# Altium schematic sheet processor.SchDoc: MSP430FR2633 EVM Processor Module
size 431 x 279 mm; Date: Not shown in title block; ApprovedBy: Not shown in title block; CheckedBy: Not shown in title block; Author: Not shown in title block; CompanyName: Not shown in title block; Engineer: Not shown in title block; Organization: Not shown in title block; Address1: Not shown in title block; Address2: Not shown in title block; Address3: Not shown in title block; Address4: Not shown in title block; DocumentNumber: 2; Revision: Use project parameter SCH_Rev; SheetNumber: 2; SheetTotal: 3; PageSetup: Record=PageOptions|CenterHorizontal=True|CenterVertical=True|PrintScale=1.00|XCorrection=1.00|YCorrection=1.00|PrintKind=0|BorderSize=5000000|LeftOffset=0|BottomOffset=0|Orientation=2|PaperLength=1000|PaperWidth=1000|Scale=100|PaperSource=15|PrintQuality=600|MediaType=1|DitherType=10|PaperKind=Letter|PrintScaleMode=1; CurrentTime: Not shown in title block; CurrentDate: Not shown in title block; Time: Not shown in title block; DocumentFullPathAndName: Not shown in title block; DocumentName: Not shown in title block; ModifiedDate: Not shown in title block; ImagePath: Not shown in title block
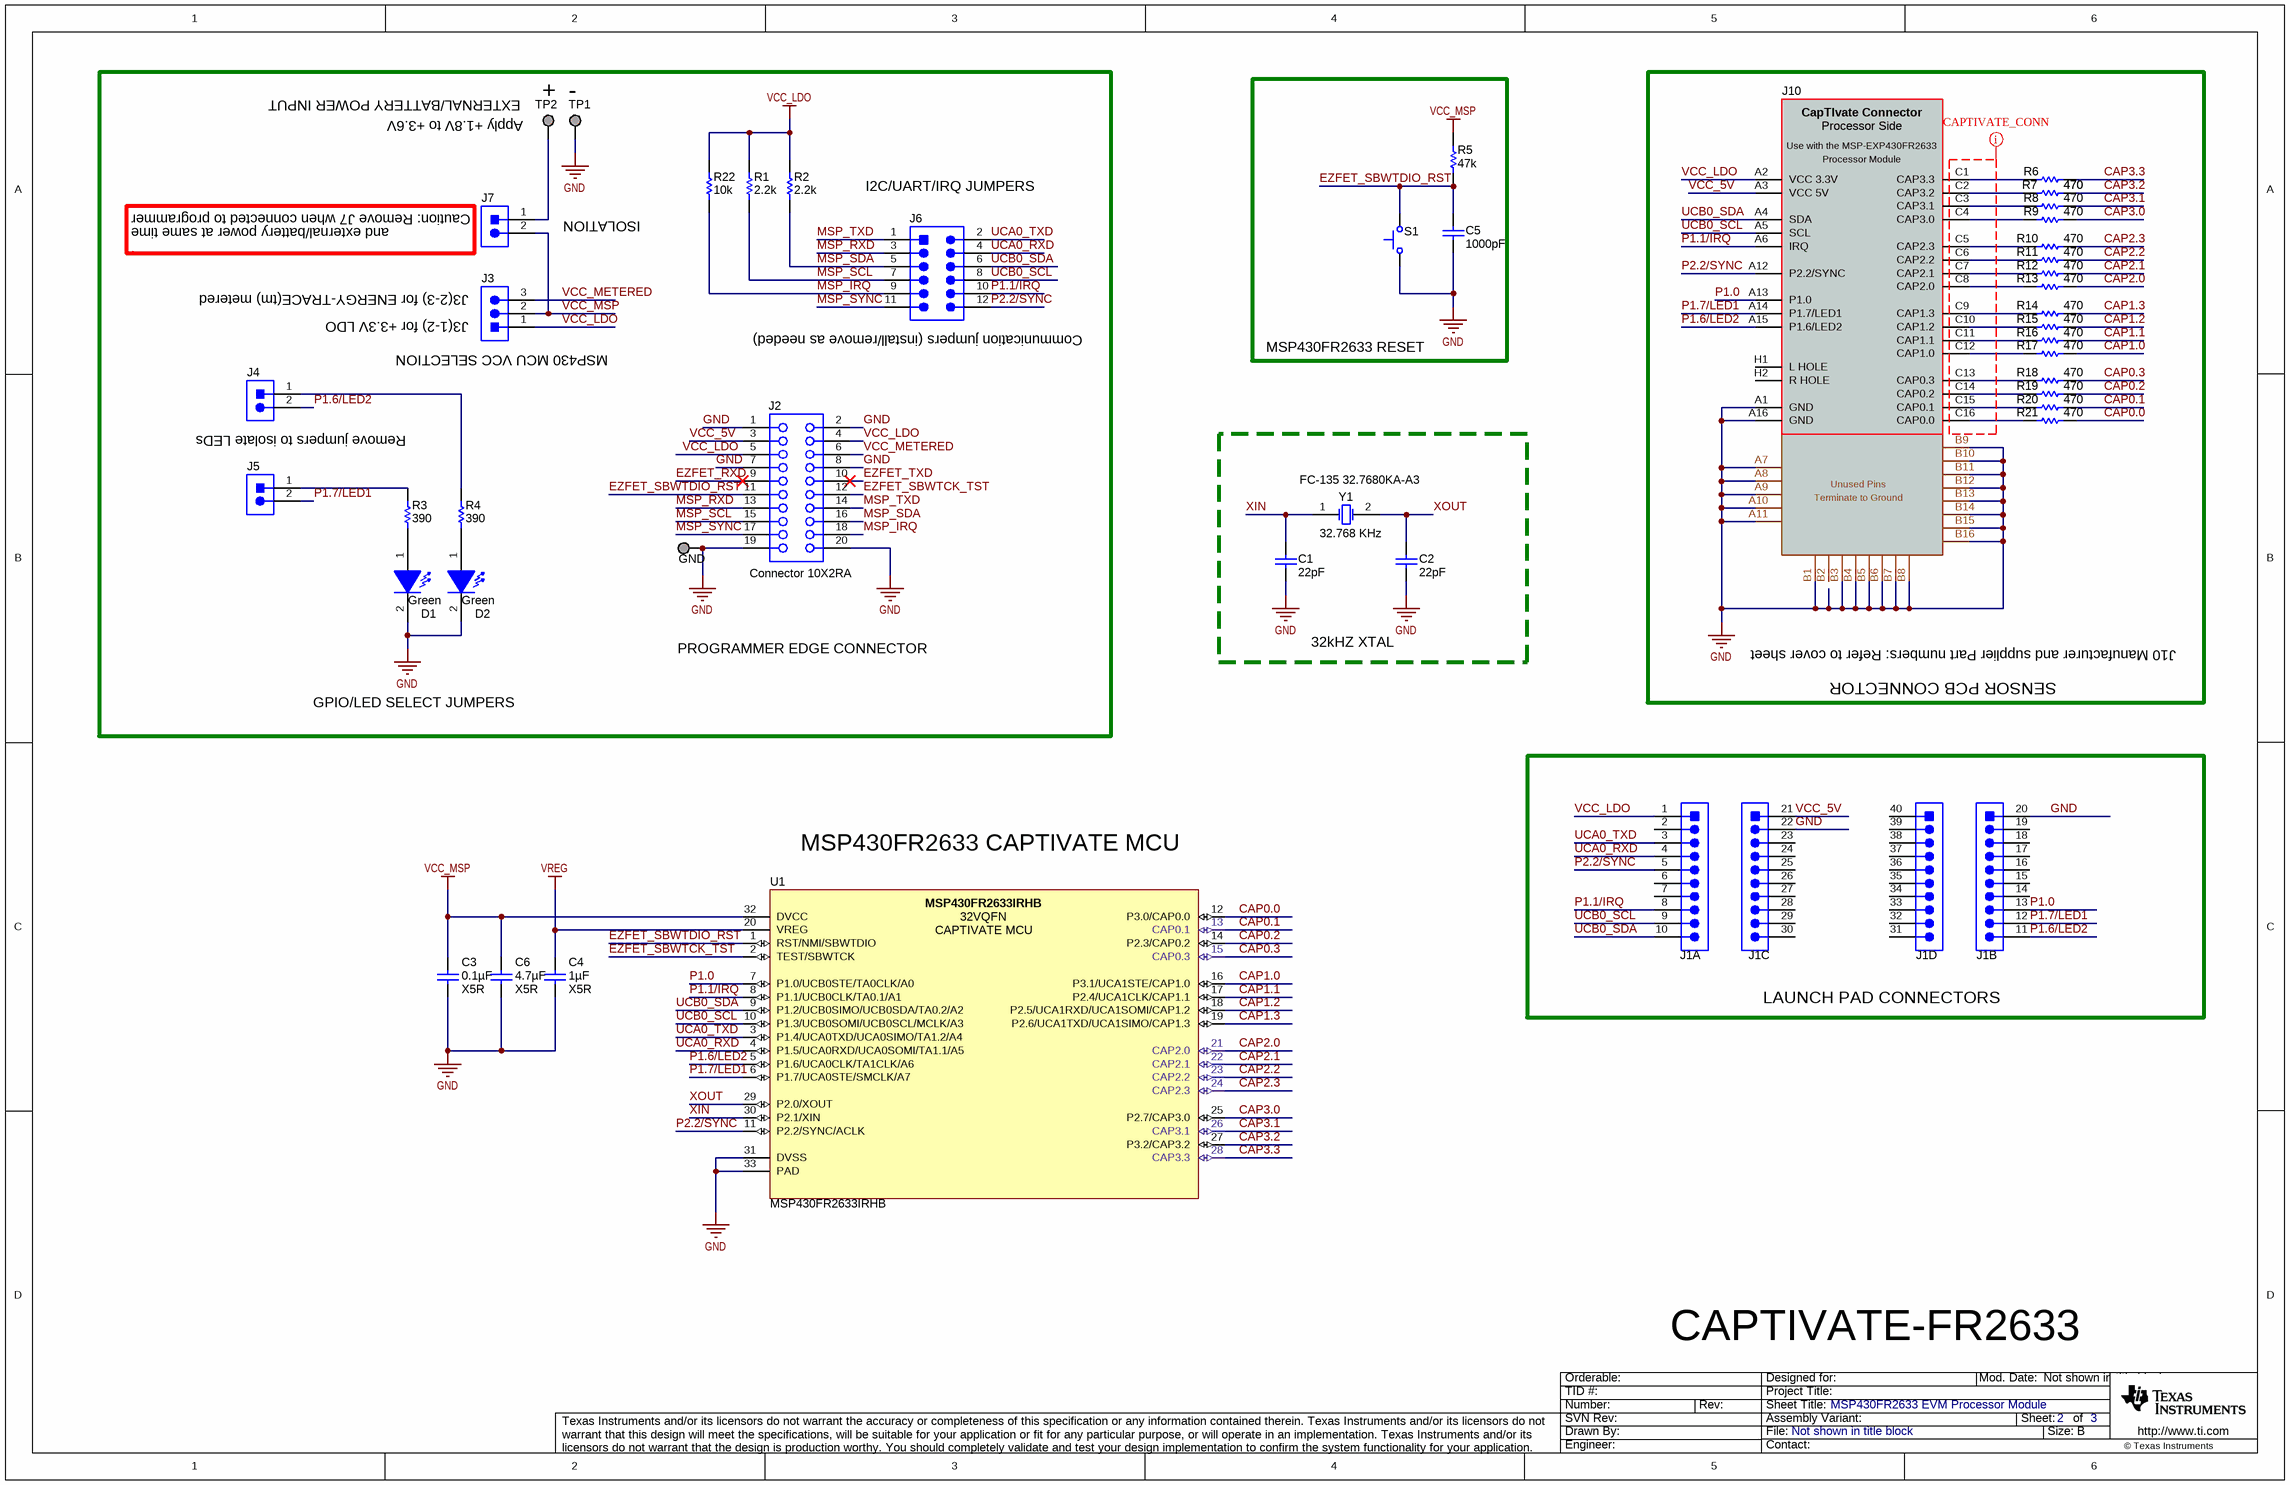
[diagram p0: processor.SchDoc]

## Parts
C1  ValueDisplayed: 22pF  [0402]  (hidden comment: GRM1555C1H220JA01D)
C2  ValueDisplayed: 22pF  [0402]  (hidden comment: GRM1555C1H220JA01D)
C3  ValueDisplayed: 0.1µF  TempCo: X5R  [0402]  (hidden comment: C1005X5R1A104K)
C4  ValueDisplayed: 1µF  TempCo: X5R  [0603]  (hidden comment: C1608X5R1A105K)
C5  ValueDisplayed: 1000pF  [0402]  (hidden comment: C1005X7R1H102K)
C6  ValueDisplayed: 4.7µF  TempCo: X5R  [0603]  (hidden comment: CGB3B1X5R1A475K055AC)
D1  value Green  [LED_LTST-C190]  (hidden comment: LTST-C190GKT)
D2  value Green  [LED_LTST-C190]  (hidden comment: LTST-C190GKT)
GND  TESTPOINT  [TP_VIA_060RND040]  (value not drawn)  (no BOM)
J1  TSW-110-07-G-S  [40Pin BP]  (value not drawn)  (parts A,B,C,D of 4)
J2  Connector 10X2RA  [CONN2X10RA]
J3  HTSW-103-07-G-S  [Samtec_HTSW-103-07-G-S]  (value not drawn)
J4  HTSW-102-07-G-S  [Samtec_HTSW-102-07-G-S]  (value not drawn)
J5  HTSW-102-07-G-S  [Samtec_HTSW-102-07-G-S]  (value not drawn)
J6  TSW-106-07-G-D  [TSW-106-07-G-D]  (value not drawn)
J7  HTSW-102-07-G-S  [Samtec_HTSW-102-07-G-S]  (value not drawn)
J10  09 28 248 6921  [CAPTIVATE-CONN-48-NONUM]  (value not drawn)
R1  ValueDisplayed: 2.2k  [0402]  (hidden comment: CRCW04022K20JNED)
R2  ValueDisplayed: 2.2k  [0402]  (hidden comment: CRCW04022K20JNED)
R3  value 390  [0402]  (hidden comment: CRCW0402390RJNED)
R4  value 390  [0402]  (hidden comment: CRCW0402390RJNED)
R5  value 47k  [0402]  (hidden comment: CRCW040247K0JNED)
R6  ValueDisplayed: 470  [0402]  (hidden comment: CRCW0402470RJNED)
R7  ValueDisplayed: 470  [0402]  (hidden comment: CRCW0402470RJNED)
R8  ValueDisplayed: 470  [0402]  (hidden comment: CRCW0402470RJNED)
R9  ValueDisplayed: 470  [0402]  (hidden comment: CRCW0402470RJNED)
R10  ValueDisplayed: 470  [0402]  (hidden comment: CRCW0402470RJNED)
R11  ValueDisplayed: 470  [0402]  (hidden comment: CRCW0402470RJNED)
R12  ValueDisplayed: 470  [0402]  (hidden comment: CRCW0402470RJNED)
R13  ValueDisplayed: 470  [0402]  (hidden comment: CRCW0402470RJNED)
R14  ValueDisplayed: 470  [0402]  (hidden comment: CRCW0402470RJNED)
R15  ValueDisplayed: 470  [0402]  (hidden comment: CRCW0402470RJNED)
R16  ValueDisplayed: 470  [0402]  (hidden comment: CRCW0402470RJNED)
R17  ValueDisplayed: 470  [0402]  (hidden comment: CRCW0402470RJNED)
R18  ValueDisplayed: 470  [0402]  (hidden comment: CRCW0402470RJNED)
R19  ValueDisplayed: 470  [0402]  (hidden comment: CRCW0402470RJNED)
R20  ValueDisplayed: 470  [0402]  (hidden comment: CRCW0402470RJNED)
R21  ValueDisplayed: 470  [0402]  (hidden comment: CRCW0402470RJNED)
R22  ValueDisplayed: 10k  [0402]  (hidden comment: CRCW040210K0JNED)
S1  EVQ-21505R  [SW_EVQ-21x05]  (value not drawn)
TP1  -  [TESTPOINT]  (no BOM)
TP2  +  [TESTPOINT]  (no BOM)
U1  MSP430FR2633IRHB  [RHB0032E]
Y1  FC-135 32.7680KA-A3  Frequency: 32.768 KHz  [Epson_FC-135]

## Blocks framed on the sheet
MSP430FR2633 RESET: C5 R5 S1
SENSOR PCB CONNECTOR: J10 R6-R21
32kHZ XTAL: C1 C2 Y1
LAUNCH PAD CONNECTORS: J1

## Nets
GND: C1.2 C2.2 C3.2 C4.2 C5.2 C6.2 D1.2(K) D2.2(K) GND.1 J1.20 J1.22 J2.1 J2.2 J2.7 J2.8 J2.19 J2.20 J10.A1(GND) J10.A7 J10.A8 J10.A9 J10.A10 J10.A11 J10.A16(GND) J10.B1 J10.B3 J10.B4 J10.B5 J10.B6 J10.B7 J10.B8 J10.B9 J10.B10 J10.B11 J10.B12 J10.B13 J10.B14 J10.B15 J10.B16 S1.1 TP1.1 U1.31(DVSS) U1.33(PAD)
VCC_LDO: J1.1 J2.4 J2.5 J3.1 J10.A2(VCC_3.3V) R1.2 R2.2 R22.2
VCC_MSP: C3.1 C6.1 J3.2 J7.2 R5.2 U1.32(DVCC)
VREG: C4.1 U1.20(VREG)
CAP0.0: R21.2 U1.12(P3.0/CAP0.0)
CAP0.1: R20.2 U1.13(CAP0.1)
CAP0.2: R19.2 U1.14(P2.3/CAP0.2)
CAP0.3: R18.2 U1.15(CAP0.3)
CAP1.0: R17.2 U1.16(P3.1/UCA1STE/CAP1.0)
CAP1.1: R16.2 U1.17(P2.4/UCA1CLK/CAP1.1)
CAP1.2: R15.2 U1.18(P2.5/UCA1RXD/UCA1SOMI/CAP1.2)
CAP1.3: R14.2 U1.19(P2.6/UCA1TXD/UCA1SIMO/CAP1.3)
CAP2.0: R13.2 U1.21(CAP2.0)
CAP2.1: R12.2 U1.22(CAP2.1)
CAP2.2: R11.2 U1.23(CAP2.2)
CAP2.3: R10.2 U1.24(CAP2.3)
CAP3.0: R9.2 U1.25(P2.7/CAP3.0)
CAP3.1: R8.2 U1.26(CAP3.1)
CAP3.2: R7.2 U1.27(P3.2/CAP3.2)
CAP3.3: R6.2 U1.28(CAP3.3)
EZFET_RXD: J2.9
EZFET_SBWTCK_TST: J2.12 U1.2(TEST/SBWTCK)
EZFET_SBWTDIO_RST: C5.1 J2.11 R5.1 S1.2 U1.1(RST/NMI/SBWTDIO)
EZFET_TXD: J2.10
MSP_IRQ: J2.18 J6.9 R22.1
MSP_RXD: J2.13 J6.3
MSP_SCL: J2.15 J6.7 R1.1
MSP_SDA: J2.16 J6.5 R2.1
MSP_SYNC: J2.17 J6.11
MSP_TXD: J2.14 J6.1
P1.0: J1.13 J10.A13(P1.0) U1.7(P1.0/UCB0STE/TA0CLK/A0)
P1.1/IRQ: J1.8 J6.10 J10.A6(IRQ) U1.8(P1.1/UCB0CLK/TA0.1/A1)
P1.6/LED2: J1.11 J4.2 J10.A15(P1.6/LED2) U1.5(P1.6/UCA0CLK/TA1CLK/A6)
P1.7/LED1: J1.12 J5.2 J10.A14(P1.7/LED1) U1.6(P1.7/UCA0STE/SMCLK/A7)
P2.2/SYNC: J1.5 J6.12 J10.A12(P2.2/SYNC) U1.11(P2.2/SYNC/ACLK)
UCA0_RXD: J1.4 J6.4 U1.4(P1.5/UCA0RXD/UCA0SOMI/TA1.1/A5)
UCA0_TXD: J1.3 J6.2 U1.3(P1.4/UCA0TXD/UCA0SIMO/TA1.2/A4)
UCB0_SCL: J1.9 J6.8 J10.A5(SCL) U1.10(P1.3/UCB0SOMI/UCB0SCL/MCLK/A3)
UCB0_SDA: J1.10 J6.6 J10.A4(SDA) U1.9(P1.2/UCB0SIMO/UCB0SDA/TA0.2/A2)
VCC_5V: J1.21 J2.3 J10.A3(VCC_5V)
VCC_METERED: J2.6 J3.3
XIN: C1.1 U1.30(P2.1/XIN) Y1.1(OSC1)
XOUT: C2.1 U1.29(P2.0/XOUT) Y1.2(OSC2)
NetD1_1: D1.1(A) R3.1
NetD2_1: D2.1(A) R4.1
NetJ4_1: J4.1 R4.2
NetJ5_1: J5.1 R3.2
NetJ7_1: J7.1 TP2.1
NetJ10_C1: J10.C1(CAP3.3) R6.1
NetJ10_C2: J10.C2(CAP3.2) R7.1
NetJ10_C3: J10.C3(CAP3.1) R8.1
NetJ10_C4: J10.C4(CAP3.0) R9.1
NetJ10_C5: J10.C5(CAP2.3) R10.1
NetJ10_C6: J10.C6(CAP2.2) R11.1
NetJ10_C7: J10.C7(CAP2.1) R12.1
NetJ10_C8: J10.C8(CAP2.0) R13.1
NetJ10_C9: J10.C9(CAP1.3) R14.1
NetJ10_C10: J10.C10(CAP1.2) R15.1
NetJ10_C11: J10.C11(CAP1.1) R16.1
NetJ10_C12: J10.C12(CAP1.0) R17.1
NetJ10_C13: J10.C13(CAP0.3) R18.1
NetJ10_C14: J10.C14(CAP0.2) R19.1
NetJ10_C15: J10.C15(CAP0.1) R20.1
NetJ10_C16: J10.C16(CAP0.0) R21.1

Not connected (* = marked no-connect by the designer): J1 2 6 7 14 15 16 17 18 19 23 24 25 26 27 28 29 30 31 32 33 34 35 36 37 38 39 40; J10 B2 H1(L_HOLE) H2(R_HOLE)

## Layout directives
net class CAPTIVATE_CONNS: (no net found under the mark)

## Notes on the sheet
- EXTERNAL/BATTERY POWER INPUT
- (near TP2) Apply +1.8V to +3.6V
- and external/battery power at same time
- (near J7) Caution: Remove J7 when connected to programmer
- ISOLATION
- (near J6) I2C/UART/IRQ JUMPERS
- (near J3) J3(2-3) for ENERGY-TRACE(tm) metered
- (near J3) J3(1-2) for +3.3V LDO
- (near J3) MSP430 MCU VCC SELECTION
- (near J6) Communication jumpers (install/remove as needed)
- Remove jumpers to isolate LEDs
- GPIO/LED SELECT JUMPERS
- PROGRAMMER EDGE CONNECTOR
- J10 Manufacturer and supplier Part numbers: Refer to cover sheet
- MSP430FR2633 CAPTIVATE MCU
- CAPTIVATE-FR2633
- Drawn By:
- SVN Rev:
- Number:
- TID #:
- Orderable:
- Rev:
- Sheet Title:
- File:
- Project Title:
- Designed for:
- Assembly Variant:
- Mod. Date:
- Sheet:
- Size:
- of
- B
- http://www.ti.com
- Texas Instruments and/or its licensors do not warrant the accuracy or completeness of this specification or any information contained therein. Texas Instruments and/or its licensors do not warrant that this design will meet the specifications, will be suitable for your application or fit for any particular purpose, or will operate in an implementation. Texas Instruments and/or its licensors do not warrant that the design is production worthy. You should completely validate and test your design implementation to confirm the system functionality for your application.
- Engineer:
- Contact:
- © Texas Instruments
- (in symbol CAPTIVATE-CONN-MSP-EXP430FR2633-PROC) CapTIvate Connector; Processor Side; Use with the MSP-EXP430FR2633; Processor Module; Unused Pins; Terminate to Ground
- (in symbol MSP430FR2633IRHB) 32VQFN; CAPTIVATE MCU

## Library data of the parts
C1 C2 = GRM1555C1H220JA01D: CAP, CERM, 22 pF, 50 V, +/- 5%, C0G/NP0, 0402; Manufacturer: MuRata; Polarized: N; CompType: Capacitor; Value: 22pF; U/M: EA; Cap_F: 0.000000000022; Tolerance_%: 5; Value1: Unknown; VDC_V: 50; Value2: 50V; TaMin_C: -55; TaMax_C: 125; SymbolVersion: 2008-07-09; PartNumber: GRM1555C1H220JA01D; PackageReference: 0402; RoHS: Y; MountType: SMT; Technology: Ceramic; TempCo: C0G/NP0; Cap_Case: 0402; Published: 2008-06-19; Publisher: Texas Instruments; LatestRevisionDate: 2014-12-10; ComponentLink1Description: Datasheet link; ComponentLink1URL: http://search.murata.co.jp/Ceramy/PnsearchViewAction.do?HnOFG=ON&HnNFG=ON&SEL_CNT=50&sLang=en&sKey=GRM1555C1H220JA01D&x=9&y=9&search=startwith; Supplier 1: Mouser; Supplier Part Number 1: 81-GRM1555C1H220JA1D
C3 = C1005X5R1A104K: CAP, CERM, 0.1uF, 10V, +/-10%, X5R, 0402; Manufacturer: TDK; Polarized: N; CompType: Capacitor; U/M: EA; Cap_F: 0.0000001; Tolerance_%: 10; ESR_Ohm: 0.0186; Value1: 0.0186 ohm; TaMin_C: -55; TaMax_C: 85; SymbolVersion: 2008-07-09; Value: 0.1uF; PartNumber: C1005X5R1A104K; PackageReference: 0402; RoHS: Y; VDC_V: 10; Value2: 10V; MountType: SMT; Technology: Ceramic; Cap_Case: 0402; Published: 2008-06-19; Publisher: Texas Instruments; LatestRevisionDate: 2013-11-01; ComponentLink1Description: Datasheet link; ComponentLink1URL: http://www.tdk.co.jp/tefe02/e412_c.pdf; Supplier 1: Digi-Key; Supplier Part Number 1: 445-1265-1-ND; Supplier 2: Farnell; Supplier Part Number 2: 1844111
C4 = C1608X5R1A105K: CAP, CERM, 1 µF, 10 V, +/- 10%, X5R, 0603; Manufacturer: TDK; Polarized: N; CompType: Capacitor; Value: 1uF; U/M: EA; Cap_F: 0.000001; Tolerance_%: 10; ESR_ohm: 0.0057; Value1: 0.0057 ohm; Value2: 10V; TaMin_C: -55; TaMax_C: 85; SymbolVersion: 2008-07-09; PartNumber: C1608X5R1A105K; PackageReference: 0603; RoHS: Y; VDC_V: 10; MountType: SMT; Technology: Ceramic; Cap_Case: 0603; Published: 2008-06-19; Publisher: Texas Instruments; LatestRevisionDate: 2014-12-10; ComponentLink1Description: Datasheet link; ComponentLink1URL: http://www.tdk.co.jp/tefe02/e412_c.pdf; Supplier 1: Digi-Key; Supplier Part Number 1: 445-1321-1-ND; Supplier 2: Farnell; Supplier Part Number 2: 1844204
C5 = C1005X7R1H102K: CAP, CERM, 1000pF, 50V, +/-10%, X7R, 0402; Manufacturer: TDK; Polarized: N; CompType: Capacitor; U/M: EA; Cap_F: 0.000000001; Tolerance_%: 10; ESR_Ohm: 0.2381; Value1: 0.2381 ohm; VDC_V: 50; TaMin_C: -55; TaMax_C: 125; SymbolVersion: 2008-07-09; Value: 1000pF; PartNumber: C1005X7R1H102K; PackageReference: 0402; RoHS: Y; Value2: 50V; MountType: SMT; Technology: Ceramic; TempCo: X7R; Cap_Case: 0402; Published: 2008-06-19; Publisher: Texas Instruments; LatestRevisionDate: 2013-11-01; ComponentLink1Description: Datasheet link; ComponentLink1URL: http://www.tdk.co.jp/tefe02/e412_c.pdf; Supplier 1: Digi-Key; Supplier Part Number 1: 445-1256-1-ND; Supplier 2: Farnell; Supplier Part Number 2: 1907278
C6 = CGB3B1X5R1A475K055AC: CAP, CERM, 4.7 µF, 10 V, +/- 10%, X5R, 0603; Manufacturer: TDK; Polarized: N; CompType: Capacitor; Value: 4.7uF; U/M: EA; Cap_F: 0.0000047; Tolerance_%: 10; Value1: Unknown; VDC_V: 10V; TaMin_C: -55; TaMax_C: 85; SymbolVersion: 2008-07-09; PartNumber: CGB3B1X5R1A475K055AC; PackageReference: 0603; RoHS: Y; Value2: 10V; MountType: SMT; Technology: Ceramic; Cap_Case: 0603; Publisher: Texas Instruments; LatestRevisionDate: 2014-12-04; ComponentLink1Description: Datasheet link; ComponentLink1URL: http://www.tdk.com/pdf/mlcc_product_guide_A12.pdf; Supplier 1: Digi-Key; Supplier Part Number 1: 445-7482-1-ND; Published: 2008-06-19
D1 D2 = LTST-C190GKT: LED, Green, SMD; Manufacturer: Lite-On; Vf_V: 2.1; Value2: 2.1V; Io_A: 0.02; Power_TotalModule: 0.1; Value1: 0.1W; U/M: EA; CompType: LED; PartNumber: LTST-C190GKT; SymbolVersion: 2008-12-08; MountType: SMT; RoHS: Y; PackageReference: 1.6x0.8x0.8mm; Type: ?; Color: green; Published: 2008-07-11; Publisher: Texas Instruments; ComponentLink1URL: https://sps06.itg.ti.com/sites/KMS/crossdivteams/altium/docs/ComponentDatasheets/LTST-C190GKT.pdf; ComponentLink1Description: Datasheet link; LatestRevisionDate: 2013-10-31; Supplier 1: Digi-Key; Supplier Part Number 1: 160-1183-1-ND; Supplier 2: Mouser; Supplier Part Number 2: 859-LTST-C190GKT
GND TP1 TP2 = TESTPOINT: TEST POINT.  No entry in BOM.; SymbolVersion: 2010-10-20; CompType: Testpoint; PackageReference: N/A; Publisher: Texas Instruments; LatestRevisionNote: Added Alternate PartNumber and Alternate Manufacturer parameters to appropriate components.
  GND: LatestRevisionDate: 2014-10-27
  TP1 TP2: LatestRevisionDate: 2014-12-30
J1 = BoosterPack Connector: Header, 100mil, 10x1, Gold, TH; Manufacturer: Samtec; SymbolCreator: a0412235; U/M: EA; SymbolVersion: 2013-12-22; PartNumber: TSW-110-07-G-S; PackageReference: 10x1 Header; ClassName: Header; CompType: Header; RoHS: Y; MountType: TH; ComponentLink1Description: Datasheet Link; ComponentLink1URL: http://samtec.com/ftppub/pdf/TSW_TH.PDF; Publisher: Texas Instruments; LatestRevisionDate: 2015-05-09; Supplier 1: Digi-Key; Supplier Part Number 1: SAM1029-10-ND
J2 = Connector 10X2RA: Connector, Female, 10-Pin, 2 row, Right Angle; Manufacturer: Samtec; PartNumber: SSW-110-22-F-D-RA; Alternate PartNumber: SSW-110-02-F-D-RA; LatestRevisionDate: 17-Jul-2002; LatestRevisionNote: Re-released for DXP Platform.; Publisher: Altium Limited
J3 = HTSW-103-07-G-S: Header, 100mil, 3x1, Gold, TH; Manufacturer: Samtec; SymbolCreator: a0799628; U/M: EA; SymbolVersion: 2013-03-28; PartNumber: HTSW-103-07-G-S; PackageReference: Header, 100mil, 3x1, TH; ClassName: Header; CompType: Header; RoHS: Y; MountType: TH; ComponentLink1Description: Datasheet Link; ComponentLink1URL: http://www.samtec.com/ftppub/pdf/TSW_TH.PDF; Publisher: Texas Instruments; LatestRevisionDate: 2015-05-09; Supplier 1: Digi-Key; Supplier Part Number 1: HTSW-103-07-G-S-ND
J4 J5 J7 = HTSW-102-07-G-S: Header, 100mil, 2x1, Gold, TH; Manufacturer: Samtec; SymbolCreator: a0412235; U/M: EA; SymbolVersion: 2013-10-31; PartNumber: HTSW-102-07-G-S; PackageReference: Header, 100mil, 2x1, TH; ClassName: Header; CompType: Header; RoHS: Y; MountType: TH; ComponentLink1Description: Datasheet Link; ComponentLink1URL: http://www.samtec.com/ftppub/pdf/TSW_TH.PDF; Publisher: Texas Instruments; LatestRevisionDate: 2015-05-09; Supplier 1: Digi-Key; Supplier Part Number 1: SAM8736-ND
J6 = TSW-106-07-G-D: Header, 100mil, 6x2, Gold, TH; Manufacturer: Samtec; SymbolCreator: a0412235; U/M: EA; SymbolVersion: 2013-12-22; PartNumber: TSW-106-07-G-D; ClassName: Header; PackageReference: 6x2 Header; CompType: Header; RoHS: Y; MountType: TH; ComponentLink1Description: Datasheet Link; ComponentLink1URL: http://samtec.com/ftppub/pdf/TSW_TH.PDF; Publisher: Texas Instruments; LatestRevisionDate: 2014-09-22; Supplier 1: Digi-Key; Supplier Part Number 1: SAM1028-06-ND
J10 = CAPTIVATE-CONN-MSP-EXP430FR2633-PROC: CapTIvate Processor-Side Connector, 3x16, 100mil, TH, RA, F, MSP-EXP430FR2633; Manufacturer: Harting; Alternate PartNumber: 5650868-4; Alternate Manufacturer: AMP/TE; SymbolVersion: use current date i.e. 2008-05-20; SymbolCreator: Use a-id; U/M: EA, IN, or GM; MountType: SMT, TH, or N/A; RoHS: Y; PartNumber: 09 28 248 6921; PackageReference: eg:  0603, used in PnP report; ComponentLink1Description: Datasheet Link; CompType: Connector; Supplier 1: Digi-Key; Supplier Part Number 1: 1195-1890-ND; Supplier 2: Digi-Key; Supplier Part Number 2: A32306-ND; Supplier Part Number 3: A32858-ND; Supplier 3: Digikey; Supplier 4: Digikey; Supplier Part Number 4: A101945-ND
R1 R2 = CRCW04022K20JNED: RES, 2.2 k, 5%, 0.063 W, 0402; Manufacturer: Vishay-Dale; CompType: Resistor; Value: 2.2k; Res_ohm: 2200; Value_Code: 2k20; Tolerance_%: 5; Power_W: 0.063; Value2: 0.063W; VDC_V: 50; TempCo: 200 ppm/C; EIA_Code: E24; U/M: EA; SymbolVersion: 2009-05-29; PartNumber: CRCW04022K20JNED; PackageReference: 0402; RoHS: Y; Value1: 5%; MountType: SMT; Technology: Thick Film; Published: 2008-06-26; Publisher: Texas Instruments; LatestRevisionDate: 2014-09-20; ComponentLink1Description: Datasheet link; ComponentLink1URL: http://www.vishay.com/docs/20035/dcrcwe3.pdf; Supplier 1: Digi-Key; Supplier Part Number 1: 541-2.2KJCT-ND; Supplier 2: Mouser; Supplier Part Number 2: 71-CRCW0402J-2.2K-E3; Supplier 3: Farnell; Supplier Part Number 3: 1514678
R3 R4 = CRCW0402390RJNED: RES, 390 ohm, 5%, 0.063W, 0402; Manufacturer: Vishay-Dale; CompType: Resistor; Value_Code: 390R; Tolerance_%: 5; Power_W: 0.063; VDC_V: 50; TempCo: 200 ppm/C; EIA_Code: E24; U/M: EA; SymbolVersion: 2009-05-29; PartNumber: CRCW0402390RJNED; PackageReference: 0402; RoHS: Y; Res_ohm: 390; Value1: 5%; Value2: 0.063W; MountType: SMT; Technology: Thick Film; Published: 2008-06-26; Publisher: Texas Instruments; LatestRevisionDate: 2013-11-01; ComponentLink1Description: Datasheet link; ComponentLink1URL: http://www.vishay.com/docs/20035/dcrcwe3.pdf; Supplier 1: Digi-Key; Supplier Part Number 1: 541-390JCT-ND; Supplier 2: Mouser; Supplier Part Number 2: 71-CRCW0402J-390-E3; Supplier 3: Farnell; Supplier Part Number 3: 1514701
R5 = CRCW040247K0JNED: RES, 47k ohm, 5%, 0.063W, 0402; Manufacturer: Vishay-Dale; CompType: Resistor; Res_ohm: 47000; Value_Code: 47k0; Tolerance_%: 5; Power_W: 0.063; VDC_V: 50; TempCo: 200 ppm/C; EIA_Code: E24; U/M: EA; SymbolVersion: 2009-05-29; PartNumber: CRCW040247K0JNED; PackageReference: 0402; RoHS: Y; Value1: 5%; Value2: 0.063W; MountType: SMT; Technology: Thick Film; Published: 2008-06-26; Publisher: Texas Instruments; LatestRevisionDate: 2013-11-01; ComponentLink1Description: Datasheet link; ComponentLink1URL: http://www.vishay.com/docs/20035/dcrcwe3.pdf; Supplier 1: Mouser; Supplier Part Number 1: 71-CRCW0402-J-47K-E3; Supplier 2: Farnell; Supplier Part Number 2: 1514553; Supplier 3: Newark; Supplier Part Number 3: 52K7099
R6-R21 = CRCW0402470RJNED: RES, 470, 5%, 0.063 W, 0402; Manufacturer: Vishay-Dale; CompType: Resistor; Value: 470; Value_Code: 470R; Tolerance_%: 5; Power_W: 0.063; Value2: 0.063W; VDC_V: 50; TempCo: 200 ppm/C; EIA_Code: E24; U/M: EA; SymbolVersion: 2009-05-29; PartNumber: CRCW0402470RJNED; PackageReference: 0402; RoHS: Y; Res_ohm: 470; Value1: 5%; MountType: SMT; Technology: Thick Film; Published: 2008-06-26; Publisher: Texas Instruments; LatestRevisionDate: 2014-09-20; ComponentLink1Description: Datasheet link; ComponentLink1URL: http://www.vishay.com/docs/20035/dcrcwe3.pdf; Supplier 1: Digi-Key; Supplier Part Number 1: 541-470JCT-ND; Supplier 2: Mouser; Supplier Part Number 2: 71-CRCW0402J-470-E3; Supplier 3: Farnell; Supplier Part Number 3: 1537425
R22 = CRCW040210K0JNED: RES, 10 k, 5%, 0.063 W, 0402; Manufacturer: Vishay-Dale; CompType: Resistor; Value: 10k; Res_ohm: 10000; Value_Code: 10k0; Tolerance_%: 5; Power_W: 0.063; Value2: 0.063W; VDC_V: 50; TempCo: 200 ppm/C; EIA_Code: E24; U/M: EA; SymbolVersion: 2009-05-29; PartNumber: CRCW040210K0JNED; PackageReference: 0402; RoHS: Y; Value1: 5%; MountType: SMT; Technology: Thick Film; Published: 2008-06-26; Publisher: Texas Instruments; LatestRevisionDate: 2014-09-20; ComponentLink1Description: Datasheet link; ComponentLink1URL: http://www.vishay.com/docs/20035/dcrcwe3.pdf; Supplier 1: Digi-Key; Supplier Part Number 1: 541-10KJCT-ND; Supplier 2: Mouser; Supplier Part Number 2: 71-CRCW0402J-10K-E3; Supplier 3: Farnell; Supplier Part Number 3: 1514663
S1 = EVQ-21505R: Switch, Tactile, SPST-NO, 0.02A, 15V, TH; Manufacturer: Panasonic; VDC_V: 15; SwitchFunction: Off-Mom; PositionCount: 1; CurrentRating_mA: 20; SymbolVersion: 2008-06-12; PartNumber: EVQ-21505R; MountType: TH; ComponentLink1Description: Datasheet URL; ComponentLink1URL: http://industrial.panasonic.com/www-data/pdf/ATK0000/ATK0000CE33.pdf; RoHS: Y; Circuit: SPST-NO; Orientation: Top Actuated; CompType: Switch; PackageReference: 6.0x5.0x6mm; Publisher: Texas Instruments; LatestRevisionDate: 2014-09-12; Supplier 1: Digi-Key; Supplier Part Number 1: P12225SCT-ND; Supplier 2: Mouser; Supplier Part Number 2: 667-EVQ-21505R; Supplier 3: Farnell; Supplier Part Number 3: 2281987
U1 = MSP430FR2633IRHB: MSP430 Captivate Microcontroller; Manufacturer: Texas Instruments; SymbolCreator: W. Schnoor; CompType: IC; U/M: EA, IN, or GM; SymbolVersion: 10-1-2014; MountType: SMT; PartNumber: MSP430FR2633IRHB; PackageReference: RHB (32VQFN); ComponentLink1Description: Datasheet Link; Alternate PartNumber: -; Alternate Manufacturer: -; Supplier 1: TI to provide; Supplier 1 PartNumber: TI to provide
Y1 = FC-135 32.7680KA-A3: Crystal, 32.768 KHz, 12.5 pF, SMD; Manufacturer: Epson; SymbolCreator: a0412235; U/M: EA; TaMin_C: -40; TaMax_C: 85; Frequency Stability: ±20ppm; SymbolVersion: 2008-07-09; PartNumber: FC-135 32.7680KA-A3; CompType: Crystal; PackageReference: SMD, 2-Leads, Body 3.2x1.5mm; MountType: SMT; RoHS: Y; ComponentLink1Description: Datasheet Link; ComponentLink1URL: http://www.epsondevice.com/docs/qd/en/DownloadServlet?id=ID000805; Publisher: Texas Instruments; LatestRevisionDate: 2015-05-11; Supplier 1: Digi-Key; Supplier Part Number 1: SE2413CT-ND; Supplier 2: Mouser; Supplier Part Number 2: 732-FC135-32.76KAA3